# Altium schematic sheet 原理图.SchDoc
size A3; PageSetup: Record=PageOptions|CenterHorizontal=True|CenterVertical=True|PrintScale=1.00|XCorrection=1.00|YCorrection=1.00|PrintKind=1|BorderSize=5000000|LeftOffset=0|BottomOffset=0|Orientation=2|PaperLength=1000|PaperWidth=1000|Scale=100|PaperSource=7|PrintQuality=-3|MediaType=1|DitherType=10|PrintScaleMode=1|PaperKind=A3|PaperIndex=8
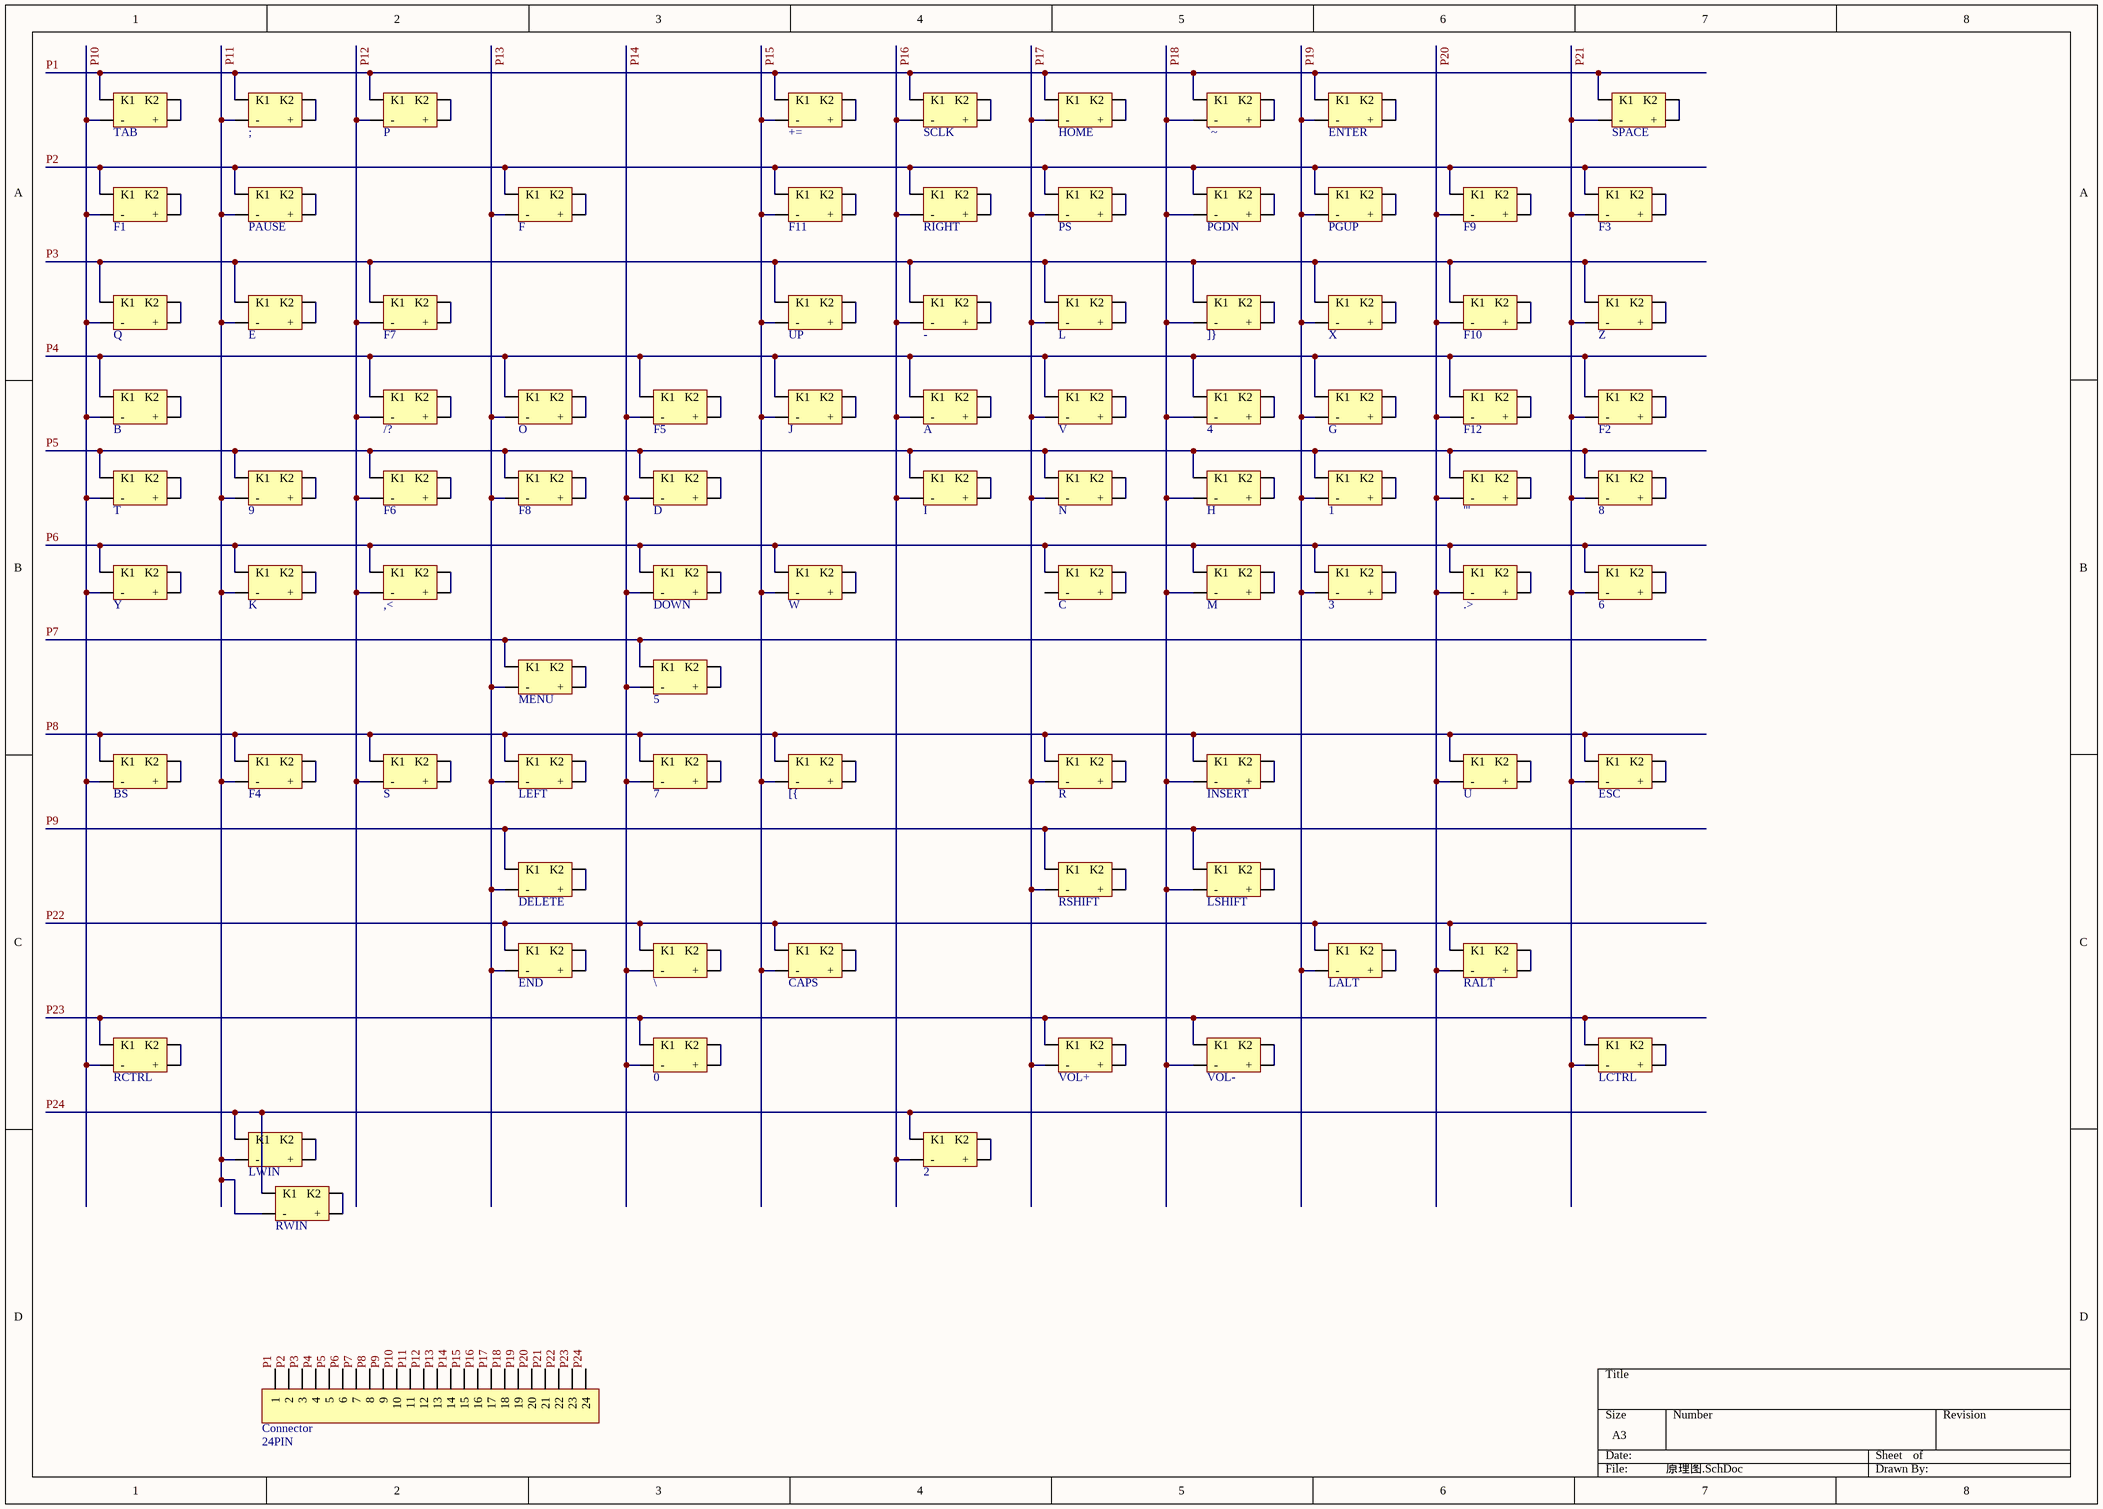
[diagram p0: 原理图.SchDoc]

## Parts
0  MX_SWITCH  [MX100]  (value not drawn)
1  MX_SWITCH  [MX100]  (value not drawn)
2  MX_SWITCH  [MX100]  (value not drawn)
3  MX_SWITCH  [MX100]  (value not drawn)
4  MX_SWITCH  [MX100]  (value not drawn)
5  MX_SWITCH  [MX100]  (value not drawn)
6  MX_SWITCH  [MX100]  (value not drawn)
7  MX_SWITCH  [MX100]  (value not drawn)
8  MX_SWITCH  [MX100]  (value not drawn)
9  MX_SWITCH  [MX100]  (value not drawn)
'"  MX_SWITCH  [MX100]  (value not drawn)
+=  MX_SWITCH  [MX100]  (value not drawn)
,<  MX_SWITCH  [MX100]  (value not drawn)
-  MX_SWITCH  [MX100]  (value not drawn)
.>  MX_SWITCH  [MX100]  (value not drawn)
/?  MX_SWITCH  [MX100]  (value not drawn)
;  MX_SWITCH  [MX100]  (value not drawn)
[{  MX_SWITCH  [MX100]  (value not drawn)
\  MX_SWITCH  [MX100]  (value not drawn)
]}  MX_SWITCH  [MX100]  (value not drawn)
`~  MX_SWITCH  [MX100]  (value not drawn)
A  MX_SWITCH  [MX100]  (value not drawn)
B  MX_SWITCH  [MX100]  (value not drawn)
BS  MX200WEI  [MX100_WEIXIN200]  (value not drawn)
C  MX_SWITCH  [MX100]  (value not drawn)
CAPS  MX_SWITCH  [MX100]  (value not drawn)
Connector  24PIN  [DIP24]
D  MX_SWITCH  [MX100]  (value not drawn)
DELETE  MX_SWITCH  [MX100]  (value not drawn)
DOWN  MX_SWITCH  [MX100]  (value not drawn)
E  MX_SWITCH  [MX100]  (value not drawn)
END  MX_SWITCH  [MX100]  (value not drawn)
ENTER  MX200WEIC  [MX_WEIXIN200_c]  (value not drawn)
ESC  MX_SWITCH  [MX100]  (value not drawn)
F  MX_SWITCH  [MX100]  (value not drawn)
F1  MX_SWITCH  [MX100]  (value not drawn)
F2  MX_SWITCH  [MX100]  (value not drawn)
F3  MX_SWITCH  [MX100]  (value not drawn)
F4  MX_SWITCH  [MX100]  (value not drawn)
F5  MX_SWITCH  [MX100]  (value not drawn)
F6  MX_SWITCH  [MX100]  (value not drawn)
F7  MX_SWITCH  [MX100]  (value not drawn)
F8  MX_SWITCH  [MX100]  (value not drawn)
F9  MX_SWITCH  [MX100]  (value not drawn)
F10  MX_SWITCH  [MX100]  (value not drawn)
F11  MX_SWITCH  [MX100]  (value not drawn)
F12  MX_SWITCH  [MX100]  (value not drawn)
G  MX_SWITCH  [MX100]  (value not drawn)
H  MX_SWITCH  [MX100]  (value not drawn)
HOME  MX_SWITCH  [MX100]  (value not drawn)
I  MX_SWITCH  [MX100]  (value not drawn)
INSERT  MX_SWITCH  [MX100]  (value not drawn)
J  MX_SWITCH  [MX100]  (value not drawn)
K  MX_SWITCH  [MX100]  (value not drawn)
L  MX_SWITCH  [MX100]  (value not drawn)
LALT  MX_SWITCH  [MX100]  (value not drawn)
LCTRL  MX_SWITCH  [MX100]  (value not drawn)
LEFT  MX_SWITCH  [MX100]  (value not drawn)
LSHIFT  MX200WEI  [MX100_WEIXIN200]  (value not drawn)
LWIN  MX_SWITCH  [MX100]  (value not drawn)
M  MX_SWITCH  [MX100]  (value not drawn)
MENU  MX_SWITCH  [MX100]  (value not drawn)
N  MX_SWITCH  [MX100]  (value not drawn)
O  MX_SWITCH  [MX100]  (value not drawn)
P  MX_SWITCH  [MX100]  (value not drawn)
PAUSE  MX_SWITCH  [MX100]  (value not drawn)
PGDN  MX_SWITCH  [MX100]  (value not drawn)
PGUP  MX_SWITCH  [MX100]  (value not drawn)
PS  MX_SWITCH  [MX100]  (value not drawn)
Q  MX_SWITCH  [MX100]  (value not drawn)
R  MX_SWITCH  [MX100]  (value not drawn)
RALT  MX_SWITCH  [MX100]  (value not drawn)
RCTRL  MX_SWITCH  [MX100]  (value not drawn)
RIGHT  MX_SWITCH  [MX100]  (value not drawn)
RSHIFT  MX200WEI  [MX100_WEIXIN200]  (value not drawn)
RWIN  MX_SWITCH  [MX100]  (value not drawn)
S  MX_SWITCH  [MX100]  (value not drawn)
SCLK  MX_SWITCH  [MX100]  (value not drawn)
SPACE  MX625WEIXIN  [MX100_WEIXIN625]  (value not drawn)
T  MX_SWITCH  [MX100]  (value not drawn)
TAB  MX_SWITCH  [MX100]  (value not drawn)
U  MX_SWITCH  [MX100]  (value not drawn)
UP  MX_SWITCH  [MX100]  (value not drawn)
V  MX_SWITCH  [MX100]  (value not drawn)
VOL+  MX_SWITCH  [MX100]  (value not drawn)
VOL-  MX_SWITCH  [MX100]  (value not drawn)
W  MX_SWITCH  [MX100]  (value not drawn)
X  MX_SWITCH  [MX100]  (value not drawn)
Y  MX_SWITCH  [MX100]  (value not drawn)
Z  MX_SWITCH  [MX100]  (value not drawn)

## Nets
P1: +=.0(K1) ;.0(K1) `~.0(K1) Connector.1 ENTER.0(K1) HOME.0(K1) P.0(K1) SCLK.0(K1) SPACE.0(K1) TAB.0(K1)
P2: Connector.2 F.0(K1) F1.0(K1) F3.0(K1) F9.0(K1) F11.0(K1) PAUSE.0(K1) PGDN.0(K1) PGUP.0(K1) PS.0(K1) RIGHT.0(K1)
P3: -.0(K1) ]}.0(K1) Connector.3 E.0(K1) F7.0(K1) F10.0(K1) L.0(K1) Q.0(K1) UP.0(K1) X.0(K1) Z.0(K1)
P4: 4.0(K1) /?.0(K1) A.0(K1) B.0(K1) Connector.4 F2.0(K1) F5.0(K1) F12.0(K1) G.0(K1) J.0(K1) O.0(K1) V.0(K1)
P5: 1.0(K1) 8.0(K1) 9.0(K1) '".0(K1) Connector.5 D.0(K1) F6.0(K1) F8.0(K1) H.0(K1) I.0(K1) N.0(K1) T.0(K1)
P6: 3.0(K1) 6.0(K1) ,<.0(K1) .>.0(K1) C.0(K1) Connector.6 DOWN.0(K1) K.0(K1) M.0(K1) W.0(K1) Y.0(K1)
P7: 5.0(K1) Connector.7 MENU.0(K1)
P8: 7.0(K1) [{.0(K1) BS.0(K1) Connector.8 ESC.0(K1) F4.0(K1) INSERT.0(K1) LEFT.0(K1) R.0(K1) S.0(K1) U.0(K1)
P9: Connector.9 DELETE.0(K1) LSHIFT.0(K1) RSHIFT.0(K1)
P10: B.3(-) BS.3(-) Connector.10 F1.3(-) Q.3(-) RCTRL.3(-) T.3(-) TAB.3(-) Y.3(-)
P11: 9.3(-) ;.3(-) Connector.11 E.3(-) F4.3(-) K.3(-) LWIN.3(-) PAUSE.3(-) RWIN.3(-)
P12: ,<.3(-) /?.3(-) Connector.12 F6.3(-) F7.3(-) P.3(-) S.3(-)
P13: Connector.13 DELETE.3(-) END.3(-) F.3(-) F8.3(-) LEFT.3(-) MENU.3(-) O.3(-)
P14: 0.3(-) 5.3(-) 7.3(-) \.3(-) Connector.14 D.3(-) DOWN.3(-) F5.3(-)
P15: +=.3(-) [{.3(-) CAPS.3(-) Connector.15 F11.3(-) J.3(-) UP.3(-) W.3(-)
P16: 2.3(-) -.3(-) A.3(-) Connector.16 I.3(-) RIGHT.3(-) SCLK.3(-)
P17: Connector.17 HOME.3(-) L.3(-) N.3(-) PS.3(-) R.3(-) RSHIFT.3(-) V.3(-) VOL+.3(-)
P18: 4.3(-) ]}.3(-) `~.3(-) Connector.18 H.3(-) INSERT.3(-) LSHIFT.3(-) M.3(-) PGDN.3(-) VOL-.3(-)
P19: 1.3(-) 3.3(-) Connector.19 ENTER.3(-) G.3(-) LALT.3(-) PGUP.3(-) X.3(-)
P20: '".3(-) .>.3(-) Connector.20 F9.3(-) F10.3(-) F12.3(-) RALT.3(-) U.3(-)
P21: 6.3(-) 8.3(-) Connector.21 ESC.3(-) F2.3(-) F3.3(-) LCTRL.3(-) SPACE.3(-) Z.3(-)
P22: \.0(K1) CAPS.0(K1) Connector.22 END.0(K1) LALT.0(K1) RALT.0(K1)
P23: 0.0(K1) Connector.23 LCTRL.0(K1) RCTRL.0(K1) VOL+.0(K1) VOL-.0(K1)
P24: 2.0(K1) Connector.24 LWIN.0(K1) RWIN.0(K1)
Net0_1: 0.1(K2) 0.2(+)
Net1_1: 1.1(K2) 1.2(+)
Net2_1: 2.1(K2) 2.2(+)
Net3_1: 3.1(K2) 3.2(+)
Net4_1: 4.1(K2) 4.2(+)
Net5_1: 5.1(K2) 5.2(+)
Net6_1: 6.1(K2) 6.2(+)
Net7_1: 7.1(K2) 7.2(+)
Net8_1: 8.1(K2) 8.2(+)
Net9_1: 9.1(K2) 9.2(+)
Net'"_1: '".1(K2) '".2(+)
Net+=_1: +=.1(K2) +=.2(+)
Net,<_1: ,<.1(K2) ,<.2(+)
Net-_1: -.1(K2) -.2(+)
Net.>_1: .>.1(K2) .>.2(+)
Net/?_1: /?.1(K2) /?.2(+)
Net;_1: ;.1(K2) ;.2(+)
Net[{_1: [{.1(K2) [{.2(+)
Ne~{t}_1: \.1(K2) \.2(+)
Net]}_1: ]}.1(K2) ]}.2(+)
Net`~_1: `~.1(K2) `~.2(+)
NetA_1: A.1(K2) A.2(+)
NetB_1: B.1(K2) B.2(+)
NetBS_1: BS.1(K2) BS.2(+)
NetC_1: C.1(K2) C.2(+)
NetCAPS_1: CAPS.1(K2) CAPS.2(+)
NetD_1: D.1(K2) D.2(+)
NetDELETE_1: DELETE.1(K2) DELETE.2(+)
NetDOWN_1: DOWN.1(K2) DOWN.2(+)
NetE_1: E.1(K2) E.2(+)
NetEND_1: END.1(K2) END.2(+)
NetENTER_1: ENTER.1(K2) ENTER.2(+)
NetESC_1: ESC.1(K2) ESC.2(+)
NetF1_1: F1.1(K2) F1.2(+)
NetF2_1: F2.1(K2) F2.2(+)
NetF3_1: F3.1(K2) F3.2(+)
NetF4_1: F4.1(K2) F4.2(+)
NetF5_1: F5.1(K2) F5.2(+)
NetF6_1: F6.1(K2) F6.2(+)
NetF7_1: F7.1(K2) F7.2(+)
NetF8_1: F8.1(K2) F8.2(+)
NetF9_1: F9.1(K2) F9.2(+)
NetF10_1: F10.1(K2) F10.2(+)
NetF11_1: F11.1(K2) F11.2(+)
NetF12_1: F12.1(K2) F12.2(+)
NetF_1: F.1(K2) F.2(+)
NetG_1: G.1(K2) G.2(+)
NetH_1: H.1(K2) H.2(+)
NetHOME_1: HOME.1(K2) HOME.2(+)
NetI_1: I.1(K2) I.2(+)
NetINSERT_1: INSERT.1(K2) INSERT.2(+)
NetJ_1: J.1(K2) J.2(+)
NetK_1: K.1(K2) K.2(+)
NetL_1: L.1(K2) L.2(+)
NetLALT_1: LALT.1(K2) LALT.2(+)
NetLCTRL_1: LCTRL.1(K2) LCTRL.2(+)
NetLEFT_1: LEFT.1(K2) LEFT.2(+)
NetLSHIFT_1: LSHIFT.1(K2) LSHIFT.2(+)
NetLWIN_1: LWIN.1(K2) LWIN.2(+)
NetM_1: M.1(K2) M.2(+)
NetMENU_1: MENU.1(K2) MENU.2(+)
NetN_1: N.1(K2) N.2(+)
NetO_1: O.1(K2) O.2(+)
NetP_1: P.1(K2) P.2(+)
NetPAUSE_1: PAUSE.1(K2) PAUSE.2(+)
NetPGDN_1: PGDN.1(K2) PGDN.2(+)
NetPGUP_1: PGUP.1(K2) PGUP.2(+)
NetPS_1: PS.1(K2) PS.2(+)
NetQ_1: Q.1(K2) Q.2(+)
NetR_1: R.1(K2) R.2(+)
NetRALT_1: RALT.1(K2) RALT.2(+)
NetRCTRL_1: RCTRL.1(K2) RCTRL.2(+)
NetRIGHT_1: RIGHT.1(K2) RIGHT.2(+)
NetRSHIFT_1: RSHIFT.1(K2) RSHIFT.2(+)
NetRWIN_1: RWIN.1(K2) RWIN.2(+)
NetS_1: S.1(K2) S.2(+)
NetSCLK_1: SCLK.1(K2) SCLK.2(+)
NetSPACE_1: SPACE.1(K2) SPACE.2(+)
NetT_1: T.1(K2) T.2(+)
NetTAB_1: TAB.1(K2) TAB.2(+)
NetU_1: U.1(K2) U.2(+)
NetUP_1: UP.1(K2) UP.2(+)
NetV_1: V.1(K2) V.2(+)
NetVOL+_1: VOL+.1(K2) VOL+.2(+)
NetVOL-_1: VOL-.1(K2) VOL-.2(+)
NetW_1: W.1(K2) W.2(+)
NetX_1: X.1(K2) X.2(+)
NetY_1: Y.1(K2) Y.2(+)
NetZ_1: Z.1(K2) Z.2(+)

Not connected (* = marked no-connect by the designer): C 3(-)